# Altium project WCTopping.PrjPcb (part 2 of 2)
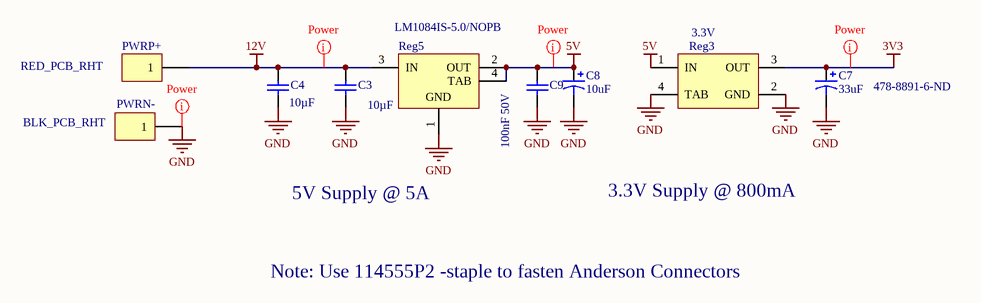
[diagram p5: Power Supply.SchDoc]

## Nets that join several sheets
3V3: CAN_Interface (C33.2 R1.2 UC1.18), Processor_Interface (C6.2 J4.1 J4.17), Digital_IO (C1.2 J1.3 J3.1), Relay_IO (U1.1 U1.2 U1.7), Power Supply (C7.1 Reg3.3)
5V: CAN_Interface (C51.2 UC2.3), Processor_Interface (C5.2 J4.2 J4.4), Digital_IO (19 pins), Power Supply (5 pins)
12V: Relay_IO (7 pins), Power Supply (C3.2 C4.2 PWRP+.1 Reg5.3)
GND: CAN_Interface (13 pins), Processor_Interface (10 pins), Digital_IO (25 pins), Relay_IO (5 pins), Power Supply (9 pins)
~{CS}: Processor_Interface (J4.24), Digital_IO (J3.3)
CLK_N: Processor_Interface (J4.5), Digital_IO (J1.1)
CLK_P: Processor_Interface (J4.3), Digital_IO (J1.2)
GPIO4: CAN_Interface (UC1.16), Processor_Interface (J4.7), Digital_IO (UI1.11)
GPIO12: Processor_Interface (J4.32), Digital_IO (UI1.20)
GPIO16: Processor_Interface (J4.36), Digital_IO (UI1.19)
GPIO20: CAN_Interface (UC1.12), Processor_Interface (J4.38)
SPI_MISO: Processor_Interface (J4.21), Digital_IO (UI1.14)
SPI_MOSI: CAN_Interface (UC1.14), Processor_Interface (J4.19)
SPI_MOSIA: CAN_Interface (UC1.15), Digital_IO (UI1.13)
SPI_SCLK: CAN_Interface (UC1.13), Processor_Interface (J4.23), Digital_IO (UI1.12)